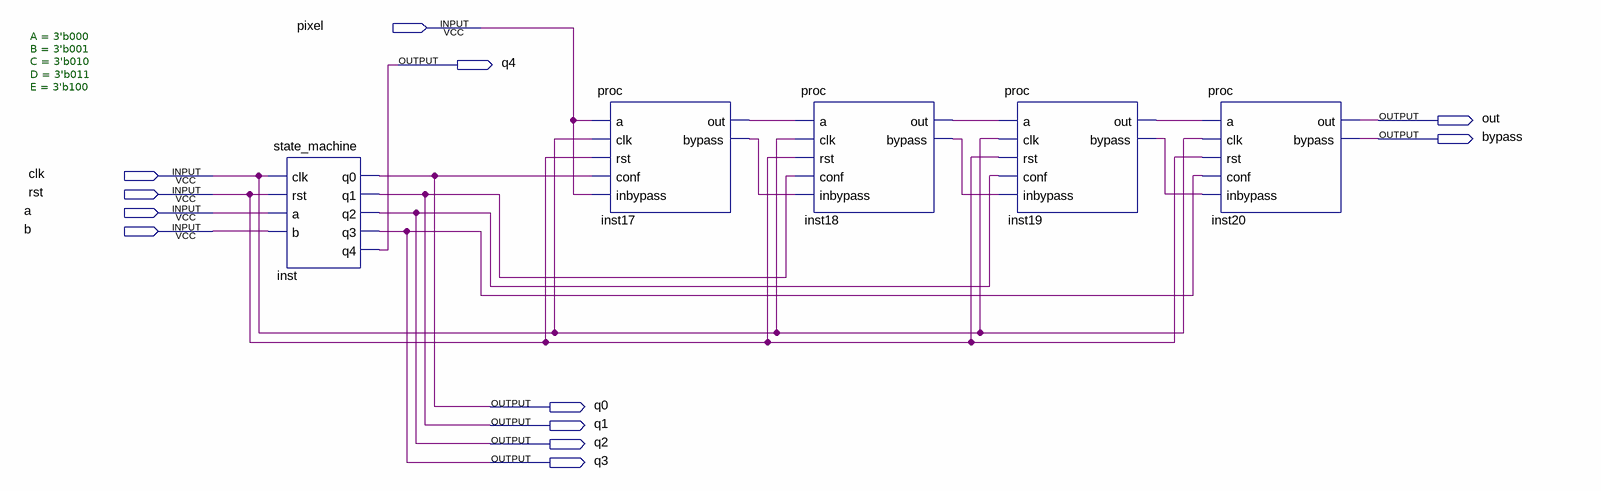
[diagram p0: schematic sheet]
// Quartus schematic processamento.bdf as structural Verilog: 5 symbols, 12 pins
module processamento (
  input  pixel,
  input  clk,
  input  rst,
  input  a,
  input  b,
  output q4,
  output out,
  output bypass,
  output q0,
  output q1,
  output q2,
  output q3
);

  wire inst17_bypass, inst17_out, inst18_bypass, inst18_out, inst19_bypass, inst19_out;

  state_machine #(.A(3'b000), .B(3'b001), .C(3'b010), .D(3'b011), .E(3'b100)) inst (
    .clk(clk), .rst(rst), .a(a), .b(b), .q0(q0), .q1(q1), .q2(q2), .q3(q3), .q4(q4));
  proc inst17 (.a(pixel), .clk(clk), .rst(rst), .conf(q0), .inbypass(pixel), .out(inst17_out), .bypass(inst17_bypass));
  proc inst18 (
    .a(inst17_out), .clk(clk), .rst(rst), .conf(q1), .inbypass(inst17_bypass), .out(inst18_out),
    .bypass(inst18_bypass));
  proc inst19 (
    .a(inst18_out), .clk(clk), .rst(rst), .conf(q2), .inbypass(inst18_bypass), .out(inst19_out),
    .bypass(inst19_bypass));
  proc inst20 (.a(inst19_out), .clk(clk), .rst(rst), .conf(q3), .inbypass(inst19_bypass), .out(out), .bypass(bypass));
endmodule
